# Altium schematic sheet GLCD.SchDoc
size A4; SheetNumber: 5; SheetTotal: 12
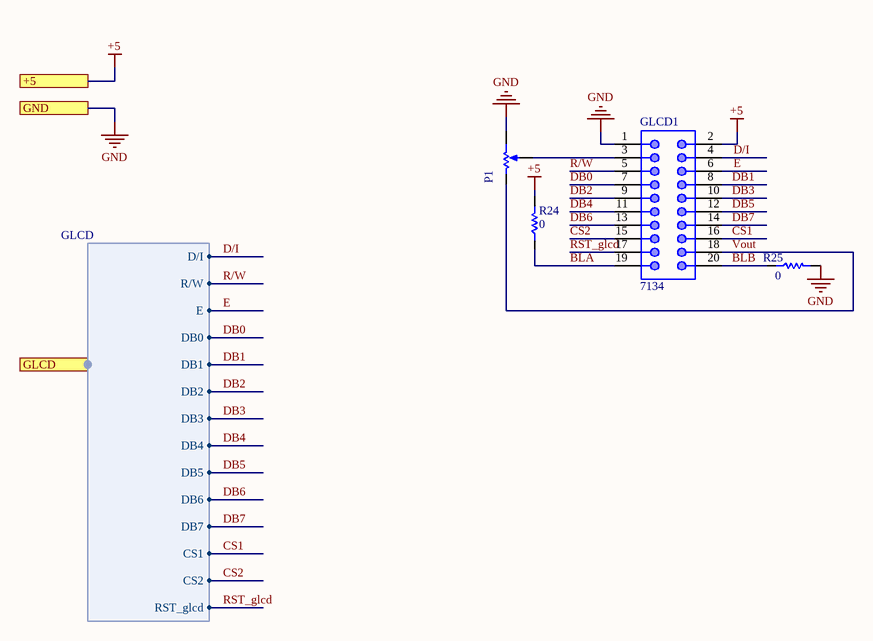
[diagram p0: GLCD.SchDoc]

## Parts
GLCD1  Inflow: 7134  [BOX-HDR-10X2-2.54mm-S]  (hidden comment: 10x2)
P1  10K  [Multi turn 01]  (value not drawn)
R24  0  [RES 1206 (3216X08L)]
R25  0  [RES 1206 (3216X08L)]

## Ports
+5, GLCD (harness GLCD), GND

## Harnesses
GLCD: D/I, R/W, E, DB0, DB1, DB2, DB3, DB4, DB5, DB6, DB7, CS1, CS2, RST_glcd

## Nets
+5: GLCD1.2 R24.2 ; port +5
GND: GLCD1.1 P1.1 R25.2 ; port GND
BLA: GLCD1.19 R24.1
BLB: GLCD1.20 R25.1
CS1: GLCD1.16 ; port GLCD.CS1
CS2: GLCD1.15 ; port GLCD.CS2
D/I: GLCD1.4 ; port GLCD.D/I
DB0: GLCD1.7 ; port GLCD.DB0
DB1: GLCD1.8 ; port GLCD.DB1
DB2: GLCD1.9 ; port GLCD.DB2
DB3: GLCD1.10 ; port GLCD.DB3
DB4: GLCD1.11 ; port GLCD.DB4
DB5: GLCD1.12 ; port GLCD.DB5
DB6: GLCD1.13 ; port GLCD.DB6
DB7: GLCD1.14 ; port GLCD.DB7
E: GLCD1.6 ; port GLCD.E
R/W: GLCD1.5 ; port GLCD.R/W
RST_glcd: GLCD1.17 ; port GLCD.RST_glcd
Vout: GLCD1.18 P1.3
NetGLCD1_3: GLCD1.3 P1.2

## Library data of the parts
GLCD1 = Con_IDC_10x2: Male Box Header, 20 pins; Rating: Rating?; Validation: NT; Value: 10x2; Package: Package?; Type: Type?
P1 = Res_Multi: Multi Turn; Rating: Rating?; Validation: Valid; Inflow: inflow?; Package: Package?; Type: Type?; Value: 10K
R24 R25 = Res_SMD_1206: Resistor; Inflow: inflow?; Rating: 0.25W; Validation: Valid; Package: 1206; Type: 10%; Value: 0